# EAGLE design schbitirme (EAGLE 9.6.2)
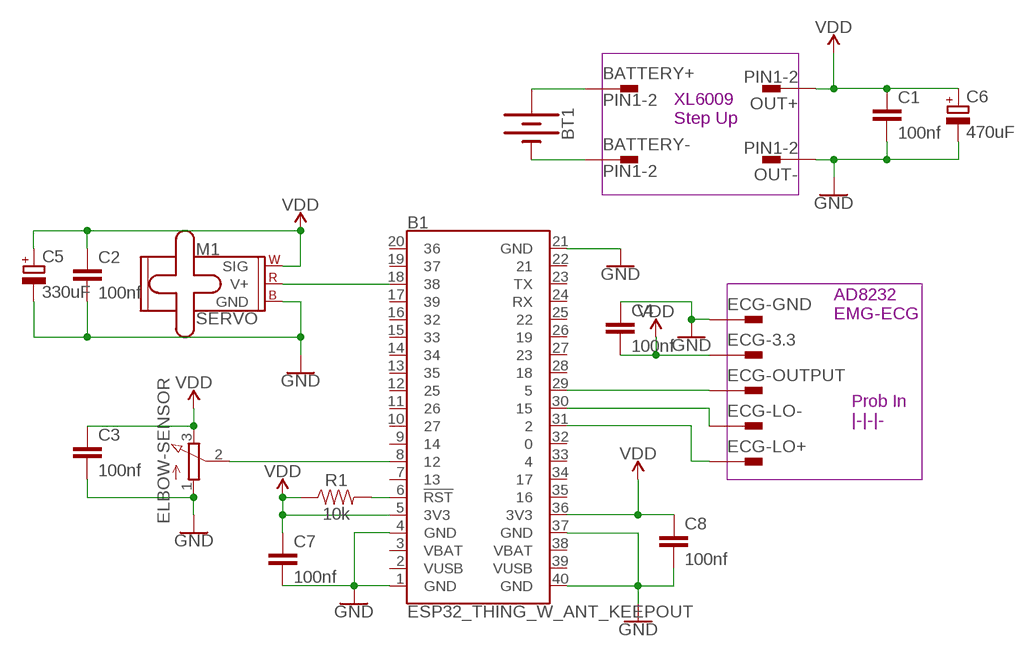
[diagram p0: schematic, sheet 1]

## Parts
B1  ESP32_THING_W_ANT_KEEPOUT  [ESP32_THING]
BATTERY+  PIN1-2  [62221]
BATTERY-  PIN1-2  [62221]
BT1  BATTERY-18650  [BATTERY_18650-HOLDER]
C1  100nf  C2,5-3  [C2.5-3]
C2  100nf  C2,5-3  [C2.5-3]
C3  100nf  C2,5-3  [C2.5-3]
C4  100nf  C2,5-3  [C2.5-3]
C5  330uF  CPOL-EUD  [PANASONIC_D]
C6  470uF  CPOL-EUD  [PANASONIC_D]
C7  100nf  C2,5-3  [C2.5-3]
C8  100nf  C2,5-3  [C2.5-3]
ECG-3.3  PIN1-2  [62221]
ECG-GND  PIN1-2  [62221]
ECG-LO+  PIN1-2  [62221]
ECG-LO-  PIN1-2  [62221]
ECG-OUTPUT  PIN1-2  [62221]
ELBOW-SENSOR  3RP/1610N  [3RP/1610N]
M1  SERVO  [1X03]
OUT+  PIN1-2  [62221]
OUT-  PIN1-2  [62221]
R1  10k  10MOHM-0603-1/10W-5%  [0603]

## Nets
GND: B1.1(GND) B1.4(GND) B1.21(GND) B1.37(GND) B1.40(GND) C1.2 C2.2 C3.2 C4.1 C5.- C6.- C7.2 C8.2 ECG-GND.1 ELBOW-SENSOR.1(A) M1.3(GND) OUT-.1
N$1: BATTERY+.1 BT1.PWR@1(+)
N$2: BATTERY-.1 BT1.GND@1(-)
N$3: B1.18 M1.2(V+)
N$4: B1.8 ELBOW-SENSOR.2(S)
N$5: B1.29 ECG-OUTPUT.1
N$6: B1.30 ECG-LO-.1
N$7: B1.31 ECG-LO+.1
N$8: B1.6(!RST!) R1.2
VDD: B1.5(3V3) B1.36(3V3) C1.1 C2.1 C3.1 C4.2 C5.+ C6.+ C7.1 C8.1 ECG-3.3.1 ELBOW-SENSOR.3(E) M1.1(SIG) OUT+.1 R1.1
Unconnected: B1.2(VUSB) B1.3(VBAT) B1.7 B1.9 B1.10 B1.11 B1.12 B1.13 B1.14 B1.15 B1.16 B1.17 B1.19 B1.20 B1.22 B1.23(TX) B1.24(RX) B1.25 B1.26 B1.27 B1.28 B1.32 B1.33 B1.34 B1.35 B1.38(VBAT) B1.39(VUSB)

## Notes on the sheet
- XL6009
  Step Up
- AD8232
  EMG-ECG
- Prob In
  |-|-|-

## Library data of the parts
B1 = SparkFun-Boards:ESP32_THING: SparkFun ESP32 Thing Board Pins, silkscreen, and logos matching the layout of the SparkFun ESP32 Thing <https://www.sparkfun.com/products/13907> Dimensions: 2.32" x 1.00"; SF_ID: DEV-13907
BATTERY+ BATTERY- ECG-3.3 ECG-GND ECG-LO+ ECG-LO- ECG-OUTPUT OUT+ OUT- = con-faston:PIN1-2: CONN TAB FASTON BRASS .187 PCB TAB, FSSTON, DUAL STAKE, .187 SERIES Digi-Key Part Number: A24734CT-ND Source: Tyco Electronics Corporation .. ENG_CD_62221_R.pdf http://search.digikey.com/scripts/DkSearch/dksus.dll?Detail&name=A24734CT-ND; MF: TYCO ELECTRONICS; MPN: 62221-1; OC_FARNELL: unknown; OC_NEWARK: 16H2318
BT1 = SparkFun-Batteries:BATTERY: Battery - Single Cell A variety of battery chemistries, sizes, and footprints. Device List: 20MM_PTH - Coin Cell Battery Holder - 20mm (PTH) <https://www.sparkfun.com/products/783> 6.8MM_PTH - Coin Cell Battery Holder - 6.8MM(SMD) <https://www.digikey.com/product-detail/en/seiko-instruments/MS621FE-FL11E/728-1057-ND/1889208?WT.srch=1&gclid=CNOQ5a6LzdQCFZS2wAodXCkE0g> 12MM_SMD - Coin Cell Battery Holder - 12mm (SMD) <https://www.sparkfun.com/products/10592> 12MM_PTH - Coin Cell Battery Holder - 12mm (PTH) <https://www.sparkfun.com/products/7948> 20MM_SMD - 20mm Coin Cell Battery Holder (SMD) (2 legs) Used on the Big Time Watch Kit <https://www.sparkfun.com/products/11734> 20MM_SMD_4LEGS - Coin Cell Battery Holder - 20mm (SMD) <https://www.sparkfun.com/products/11892> 20MM_SMD_4LEGS_OVERPASTE - Coin Cell Battery Holder - 20mm (SMD) <https://www.sparkfun.com/products/11892> (Over-paste on the legs) 24.5MM_PTH - Coin Cell Battery Holder - 24.5mm (PTH) <https://www.sparkfun.com/products/8863> 9V - 9V Battery Holder - PC Mount Used on the SparkFun SparkPunk Sound Kit <https://www.sparkfun.com/products/11177> and SparkFun SparkPunk Sequencer Kit <https://www.sparkfun.com/products/12707> 18650 - Battery Holder - 18650 (PTH) <https://www.sparkfun.com/products/13113> AA - Battery Holder - 1xAA (PTH) <https://www.sparkfun.com/products/7949> AAA - Battery Holder - 1xAAA (PTH) <https://www.sparkfun.com/products/12718> AA_KIT - Battery Holder - 1xAA (PTH) <https://www.sparkfun.com/products/7949> Special kit package - pads only have exposed copper on one side of the board. AAA_KIT - Battery Holder - 1xAAA (PTH) <https://www.sparkfun.com/products/12718> Special kit package - pads only have exposed copper on one side of the board.; PROD_ID: BATT-12327; SF_SKU: PRT-13113
C1-C4 C7 C8 = capacitor-wima:C: CAPACITOR naming: grid - package width
C5 C6 = rcl:CPOL-EU: POLARIZED CAPACITOR, European symbol; SPICEPREFIX: C
ELBOW-SENSOR = pot:3RP/1610N: 16mm Potentiometer one level Source: http://www.alphapotentiometers.net/html/16mm_pot_2.html
M1 = SparkFun-Electromechanical:SERVO: Servo Motor 3-pin connector for a standard servo motor (voltage supply, ground, and control signal.) SparkFun Products Servo - Generic (Sub-Micro Size) <https://www.sparkfun.com/products/9065> (ROB-09065) Servo - Generic High Torque Continuous Rotation (Standard Size) <https://www.sparkfun.com/products/9347> (ROB-09347) Servo - Generic High Torque (Standard Size) <https://www.sparkfun.com/products/11965> (ROB-11965)
R1 = SparkFun-Resistors:10MOHM: RES-09327; PROD_ID: RES-08283; VALUE: 10M

## Board
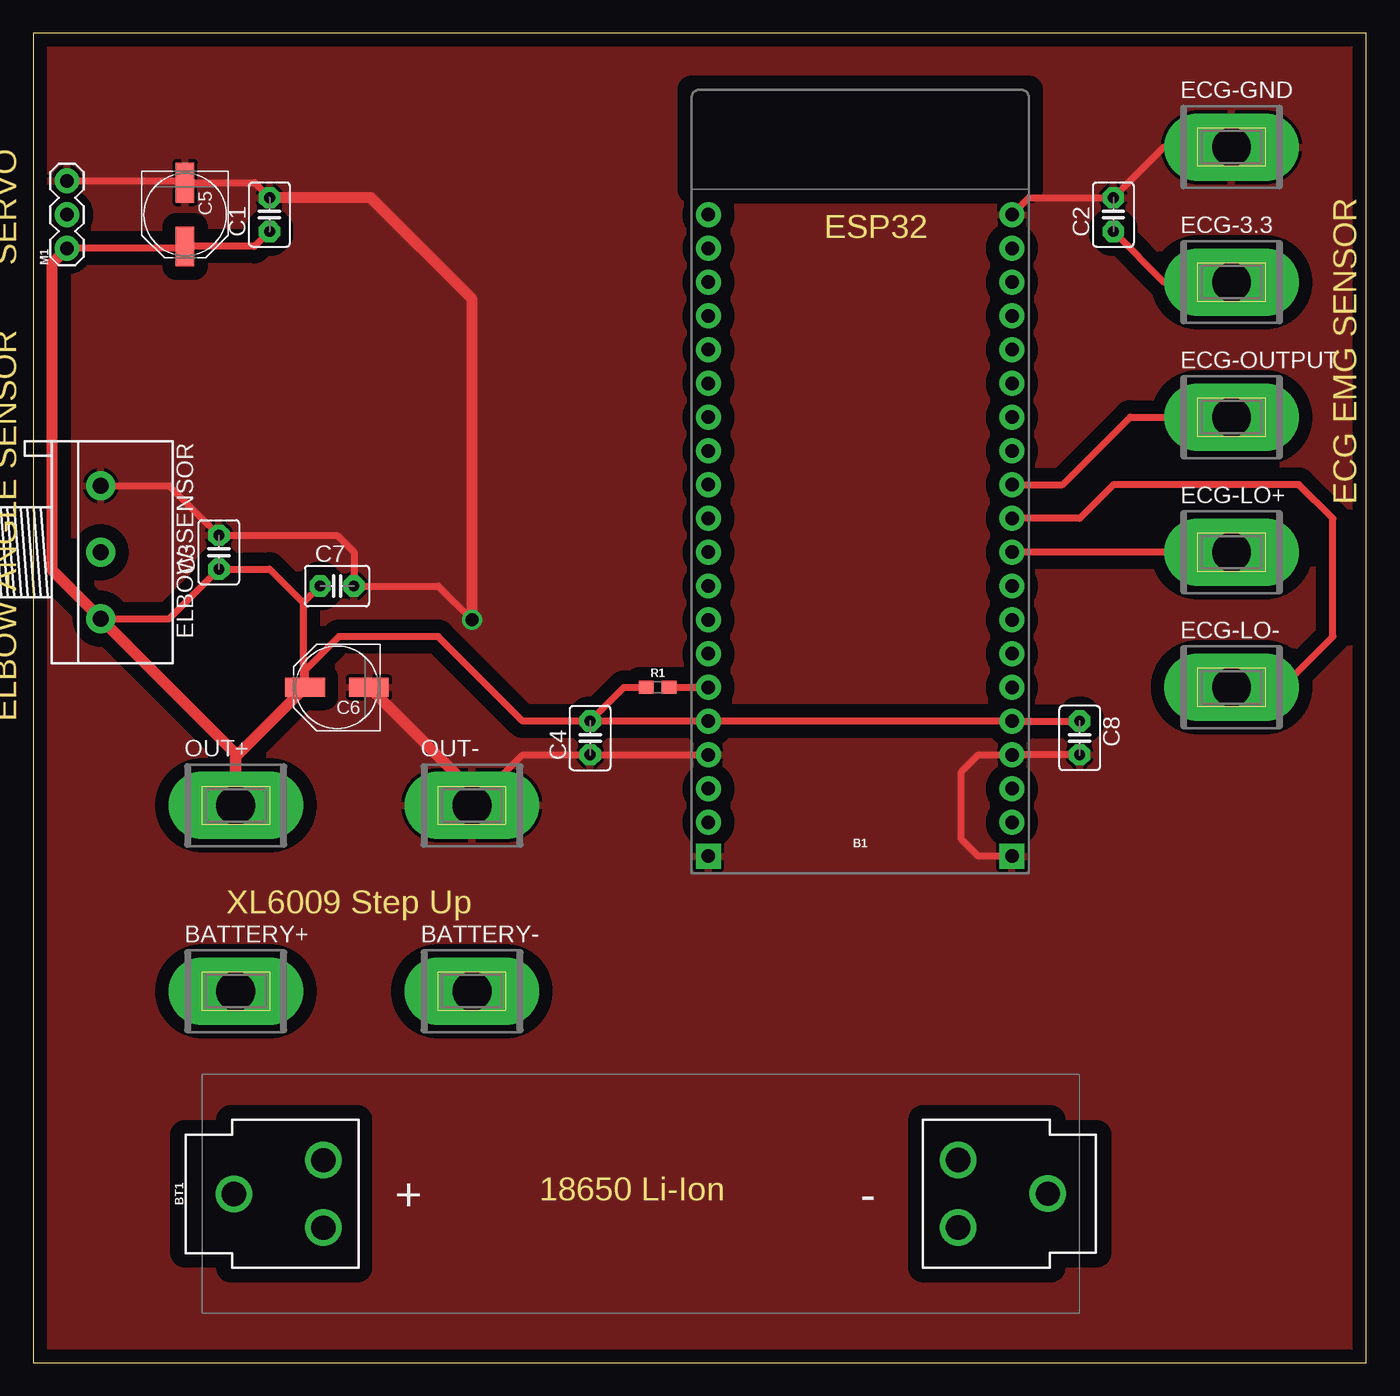
[diagram p1: board, top side]
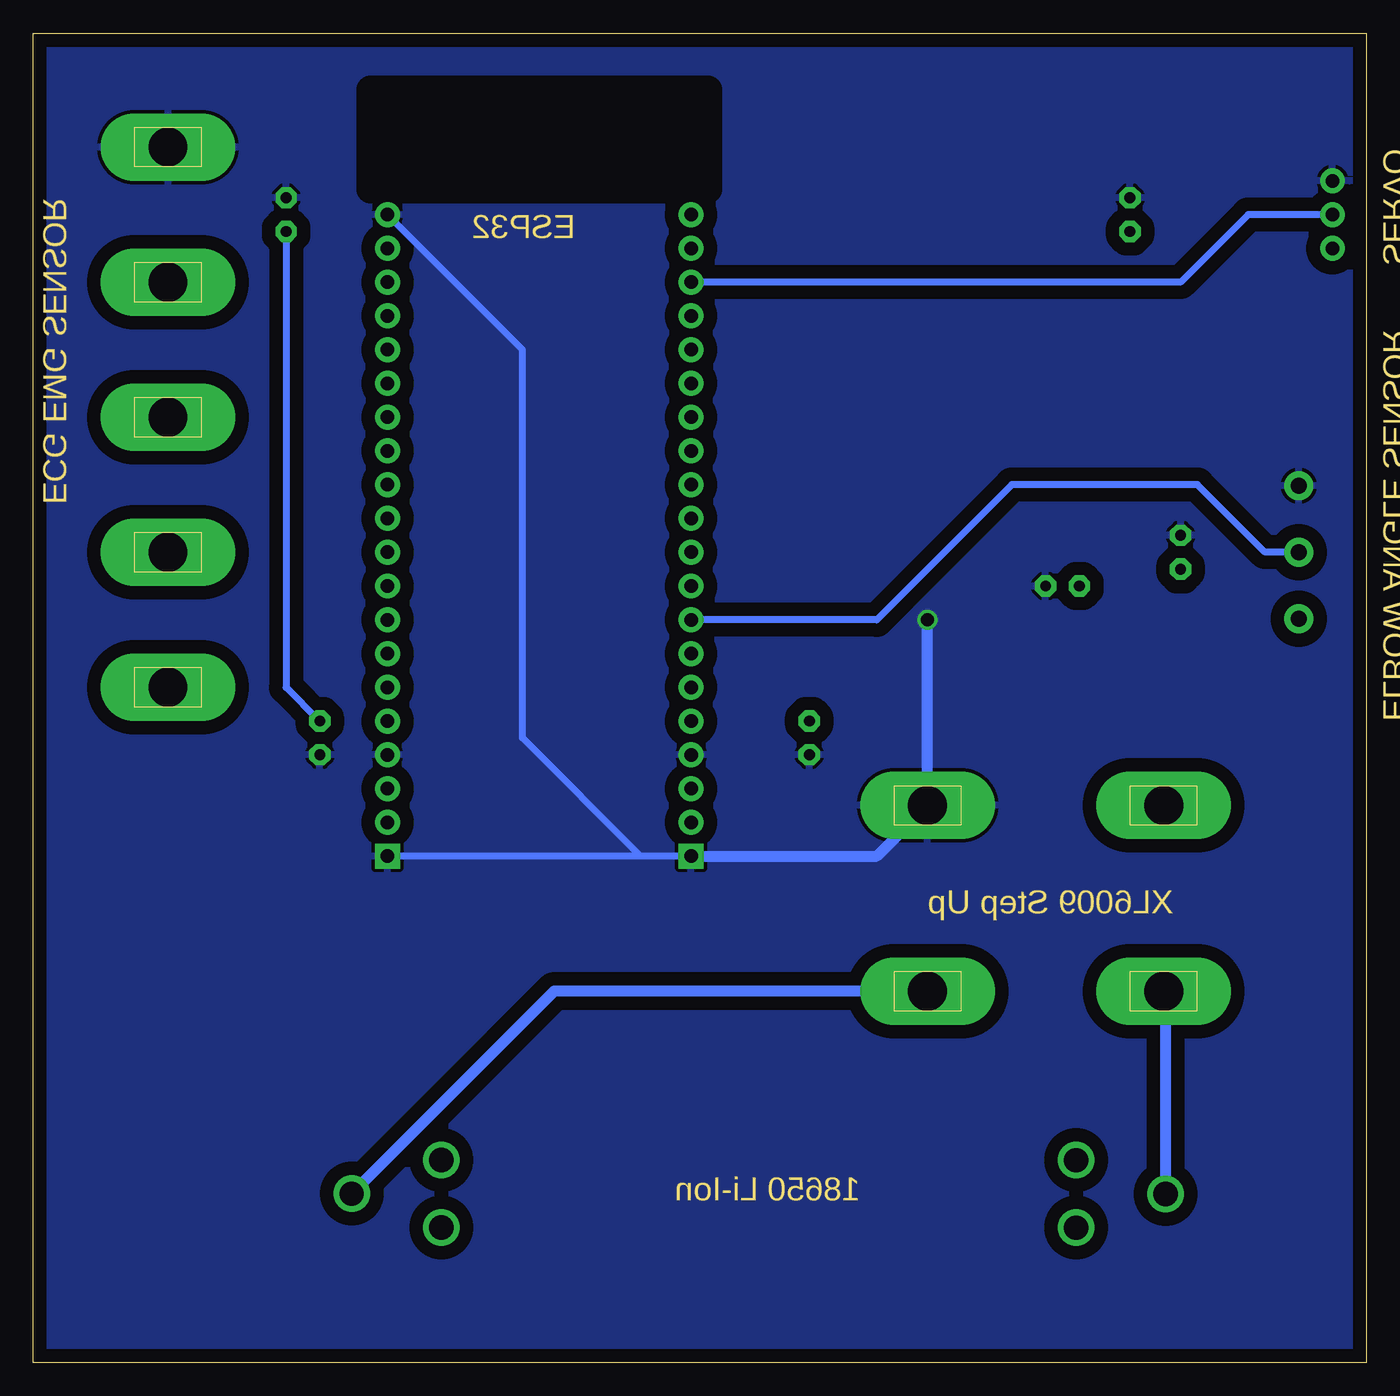
[diagram p2: board, bottom side, seen from below]

Size 100.31 x 100 mm. Coordinates in mm from the lower left corner, seen from the top.
Outline: 0,0 100.31,0 100.31,100 0,100 0,0
Copper layers (1*16): Top 0.035mm / dielectric 1.5mm / Bottom 0.035mm
Design rules "default": minimum track width 6mil, minimum drill 0.35mm, track to track 6mil, track to pad 6mil, pad to pad 6mil, via to via 6mil, smd to smd 6mil, copper to edge 40mil, drill to drill 6mil, minimum pad ring 10mil, minimum via ring 8mil, stop-mask expansion 4mil, vias tented up to drill 0mil, thermal gap 10mil

### Footprints (pad centres in the part's own frame; a part is rotated, then mirrored left to right if it is on the bottom)
ESP32_THING = drill 1.016 pad 1.88 square: 1 1.27,1.27; 40 24.13,1.27 | drill 1.016 pad 1.88: 2 1.27,3.81; 3 1.27,6.35; 4 1.27,8.89; 5 1.27,11.43; 6 1.27,13.97; 7 1.27,16.51; 8 1.27,19.05; 9 1.27,21.59; 10 1.27,24.13; 11 1.27,26.67; 12 1.27,29.21; 13 1.27,31.75; 14 1.27,34.29; 15 1.27,36.83; 16 1.27,39.37; 17 1.27,41.91; 18 1.27,44.45; 19 1.27,46.99; 20 1.27,49.53; 21 24.13,49.53; 22 24.13,46.99; 23 24.13,44.45; 24 24.13,41.91; 25 24.13,39.37; 26 24.13,36.83; 27 24.13,34.29; 28 24.13,31.75; 29 24.13,29.21; 30 24.13,26.67; 31 24.13,24.13; 32 24.13,21.59; 33 24.13,19.05; 34 24.13,16.51; 35 24.13,13.97; 36 24.13,11.43; 37 24.13,8.89; 38 24.13,6.35; 39 24.13,3.81
62221 = drill 2.921 pad 5.08 long: 1 0,0
BATTERY_18650-HOLDER = drill 1.829: GND@1 30.628,0.01; GND@2 23.88,2.55; GND@3 23.88,-2.53; PWR@1 -30.628,-0.01; PWR@2 -23.88,2.53; PWR@3 -23.88,-2.55
C2.5-3 = drill 0.813 pad 1.6 octagon: 1 -1.27,0; 2 1.27,0
PANASONIC_D = smd 3 x 1.4: + 2.4,0; - -2.4,0
3RP/1610N = drill 1.2 pad 2.184: 1 -5,0; 2 0,0; 3 5,0
1X03 = drill 1.016 pad 1.88: 1 0,0; 2 2.54,0; 3 5.08,0
0603 = smd 1.1 x 1: 1 -0.85,0; 2 0.85,0

### Placement (x,y rotation side)
B1  49.53,36.83 0 top
BATTERY+  15.24,27.94 0 top
BATTERY-  33.02,27.94 0 top
BT1  45.72,12.7 0 top
C1  17.78,86.36 90 top
C2  81.28,86.36 90 top
C3  13.97,60.96 90 top
C4  41.91,46.99 90 top
C5  11.43,86.36 270 top
C6  22.86,50.8 180 top
C7  22.86,58.42 0 top
C8  78.74,46.99 270 top
ECG-3.3  90.17,81.28 0 top
ECG-GND  90.17,91.44 0 top
ECG-LO+  90.17,60.96 0 top
ECG-LO-  90.17,50.8 0 top
ECG-OUTPUT  90.17,71.12 0 top
ELBOW-SENSOR  5.08,60.96 270 top
M1  2.54,83.82 90 top
OUT+  15.24,41.91 0 top
OUT-  33.02,41.91 0 top
R1  46.99,50.8 0 top

### Tracks (layer width: path | path; a pad name or v marks a point on that pad's centre or on a via)
GND  (via drill 1)
  Top 0.508: OUT-.1 36.83,45.72 C4.1 B1.4 | B1.40 71.12,38.1 69.85,39.37 69.85,44.45 71.12,45.72 B1.37 C8.2 | M1.3 11.29,88.9 C5.- 16.65,88.76 C1.2 | ELBOW-SENSOR.1 10.24,65.96 C3.2 22.86,62.23 24.13,60.96 C7.2 30.48,58.42 v33.02,55.88 | ECG-GND.1 85.09,91.44 C2.2 74.93,87.63 B1.21
  Top 0.813: C6.- 33.02,43.04 OUT-.1 | v33.02,55.88 33.02,80.01 25.4,87.63 C1.2
  Bottom 0.508: B1.1 54.61,38.1 | 54.61,38.1 B1.40 | 54.61,38.1 63.5,46.99 63.5,76.2 B1.21
  Bottom 0.813: B1.1 36.83,38.1 OUT-.1 v33.02,55.88
  pour Top (isolate 1.016): -3.81,101.6 -3.81,-3.81 104.14,-3.81 104.14,101.6
  pour Bottom (isolate 1.016): -7.62,102.87 -7.62,-6.35 106.68,-6.35 106.68,102.87
N$1
  Bottom 0.813: BT1.PWR@1 15.09,27.79 BATTERY+.1
N$2
  Bottom 0.813: BATTERY-.1 61.12,27.94 BT1.GND@1
N$3
  Bottom 0.508: M1.2 8.89,86.36 13.97,81.28 B1.18
N$4
  Bottom 0.508: ELBOW-SENSOR.2 7.62,60.96 12.7,66.04 26.67,66.04 36.83,55.88 B1.8
N$5
  Top 0.508: B1.29 77.47,66.04 82.55,71.12 ECG-OUTPUT.1
N$6
  Top 0.508: ECG-LO-.1 93.98,50.8 97.79,54.61 97.79,63.5 95.25,66.04 81.28,66.04 78.74,63.5 B1.30
N$7
  Top 0.508: ECG-LO+.1 B1.31
N$8
  Top 0.508: R1.2 B1.6
VDD
  Top 0.508: C4.2 44.45,50.8 R1.1 | C4.2 B1.5 B1.36 C8.1 | C4.2 36.83,48.26 30.48,54.61 23,54.61 20.46,52.07 C6.+ | C7.1 20.32,57.15 | 20.32,57.15 20.32,50.8 20.39,50.73 | C1.1 16.65,83.96 C5.+ 11.29,83.82 M1.1 | ELBOW-SENSOR.3 10.24,55.96 C3.1 17.78,59.69 20.32,57.15 | C2.1 85.09,81.28 ECG-3.3.1
  Top 0.813: C6.+ 20.39,50.73 15.24,45.58 OUT+.1 15.24,45.8 ELBOW-SENSOR.3 1.42,59.62 1.42,82.7 M1.1
  Bottom 0.508: C2.1 81.28,50.8 C8.1

### Text on the board
Dimension: ECG EMG SENSOR | ESP32 | SERVO | ELBOW ANGLE SENSOR | XL6009 Step Up | 18650 Li-Ion